# EAGLE design Spectrum_v03_g (EAGLE 7.5.4)
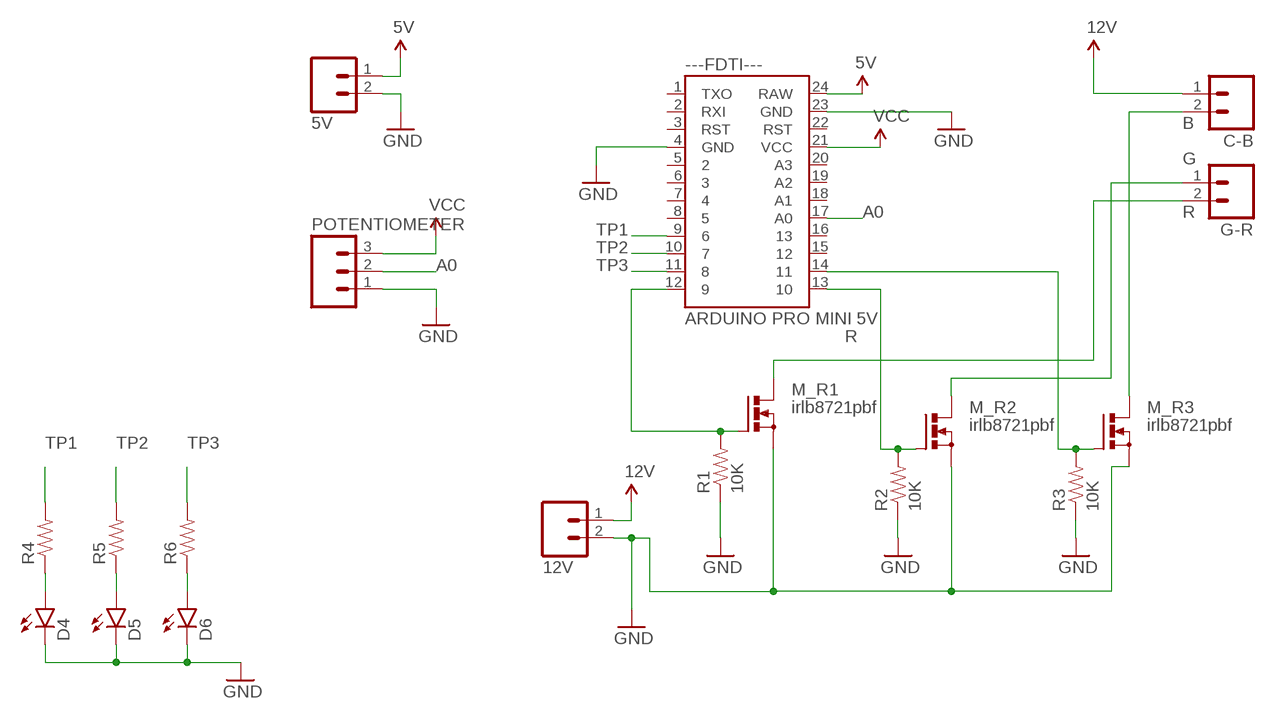
[diagram p0: schematic, sheet 1]

## Parts
5V  M025MM  [SCREWTERMINAL-5MM-2]
12V  M025MM  [SCREWTERMINAL-5MM-2]
---FDTI---  ARDUINO PRO MINI 5V  ARDUINO_MINI  [ARDUINO_MINI]
C-B  M025MM  [SCREWTERMINAL-5MM-2]
D4  LED3MM  [LED3MM]
D5  LED3MM  [LED3MM]
D6  LED3MM  [LED3MM]
G-R  M025MM  [SCREWTERMINAL-5MM-2]
M_R1  irlb8721pbf  PMOSFET_NTO220BV  [TO220BV]
M_R2  irlb8721pbf  PMOSFET_NTO220BV  [TO220BV]
M_R3  irlb8721pbf  PMOSFET_NTO220BV  [TO220BV]
POTENTIOMETER  M03-SCREW-5MM  [SCREWTERMINAL-5MM-3]
R1  10K  RESISTORPTH-1/4W  [AXIAL-0.4]
R2  10K  RESISTORPTH-1/4W  [AXIAL-0.4]
R3  10K  RESISTORPTH-1/4W  [AXIAL-0.4]
R4  RESISTOREZ  [AXIAL-0.3EZ]
R5  RESISTOREZ  [AXIAL-0.3EZ]
R6  RESISTOREZ  [AXIAL-0.3EZ]

## Nets
5V: 5V.1 ---FDTI---.24(RAW)
12V: 12V.1 C-B.1
A0: ---FDTI---.17(A0) POTENTIOMETER.2
B: C-B.2 M_R3.D
G: G-R.1 M_R2.D
GND: 5V.2 12V.2 ---FDTI---.4(GND) ---FDTI---.23(GND) D4.K(C) D5.K(C) D6.K(C) M_R1.S M_R2.S M_R3.S POTENTIOMETER.1 R1.P$1 R2.P$1 R3.P$1
N$1: ---FDTI---.12 M_R1.G R1.P$2
N$2: ---FDTI---.13 M_R2.G R2.P$2
N$3: ---FDTI---.14 M_R3.G R3.P$2
N$5: D4.A R4.P$1
N$6: D5.A R5.P$1
N$7: D6.A R6.P$1
R: G-R.2 M_R1.D
TP1: ---FDTI---.9 R4.P$2
TP2: ---FDTI---.10 R5.P$2
TP3: ---FDTI---.11 R6.P$2
VCC: ---FDTI---.21(VCC) POTENTIOMETER.3
Unconnected: ---FDTI---.1(TXO) ---FDTI---.2(RXI) ---FDTI---.3(RST) ---FDTI---.5 ---FDTI---.6 ---FDTI---.7 ---FDTI---.8 ---FDTI---.15 ---FDTI---.16 ---FDTI---.18(A1) ---FDTI---.19(A2) ---FDTI---.20(A3) ---FDTI---.22(RST)

## Library data of the parts
5V 12V C-B G-R = SparkFun-Connectors:M02: Standard 2-pin 0.1" header. Use with - straight break away headers ( PRT-00116) - right angle break away headers (PRT-00553) - swiss pins (PRT-00743) - machine pins (PRT-00117) - female headers (PRT-00115) Molex polarized connector foot print use with: PRT-08233 with associated crimp pins and housings. 2.54_SCREWTERM for use with PRT-10571. 3.5mm Screw Terminal footprints for PRT-08084 5mm Screw Terminal footprints for use with PRT-08432; STOREFRONT_ID: PRT-08432
---FDTI--- = SparkFun-Boards:ARDUINO_MINI: Arduino Pro Mini footprint
D4-D6 = SparkFun-LED:LED: LEDs Standard schematic elements and footprints for 5mm, 3mm, 1206, and 0603 sized LEDs. 5mm - Spark Fun Electronics SKU : COM-00529 (and others); PROD_ID: DIO-08794
M_R1-M_R3 = transistor-power:PMOSFET_N: Power MOSFET N-Channel
POTENTIOMETER = SparkFun-Connectors:M03: Header 3 Standard 3-pin 0.1" header. Use with straight break away headers (SKU : PRT-00116), right angle break away headers (PRT-00553), swiss pins (PRT-00743), machine pins (PRT-00117), and female headers (PRT-00115). Molex polarized connector foot print use with SKU : PRT-08232 with associated crimp pins and housings.; STOREFRONT_ID: PRT-08433
R1-R3 = SparkFun-Passives:RESISTOR: Resistor Basic schematic elements and footprints for 0603, 1206, and PTH resistors.
R4-R6 = SparkFun-Resistors:RESISTOR: Resistor Basic schematic elements and footprints for 0603, 1206, and PTH resistors.

## Board
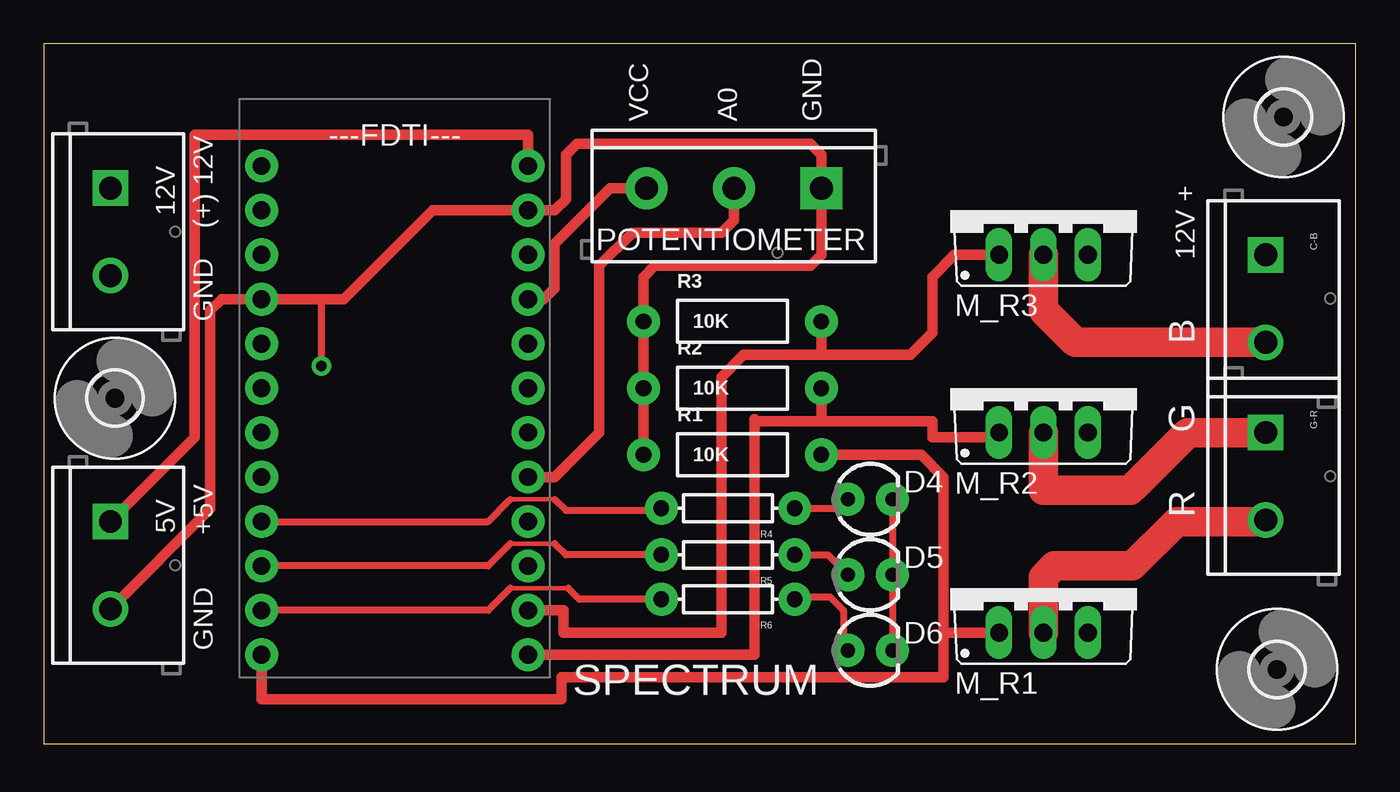
[diagram p1: board, top side]
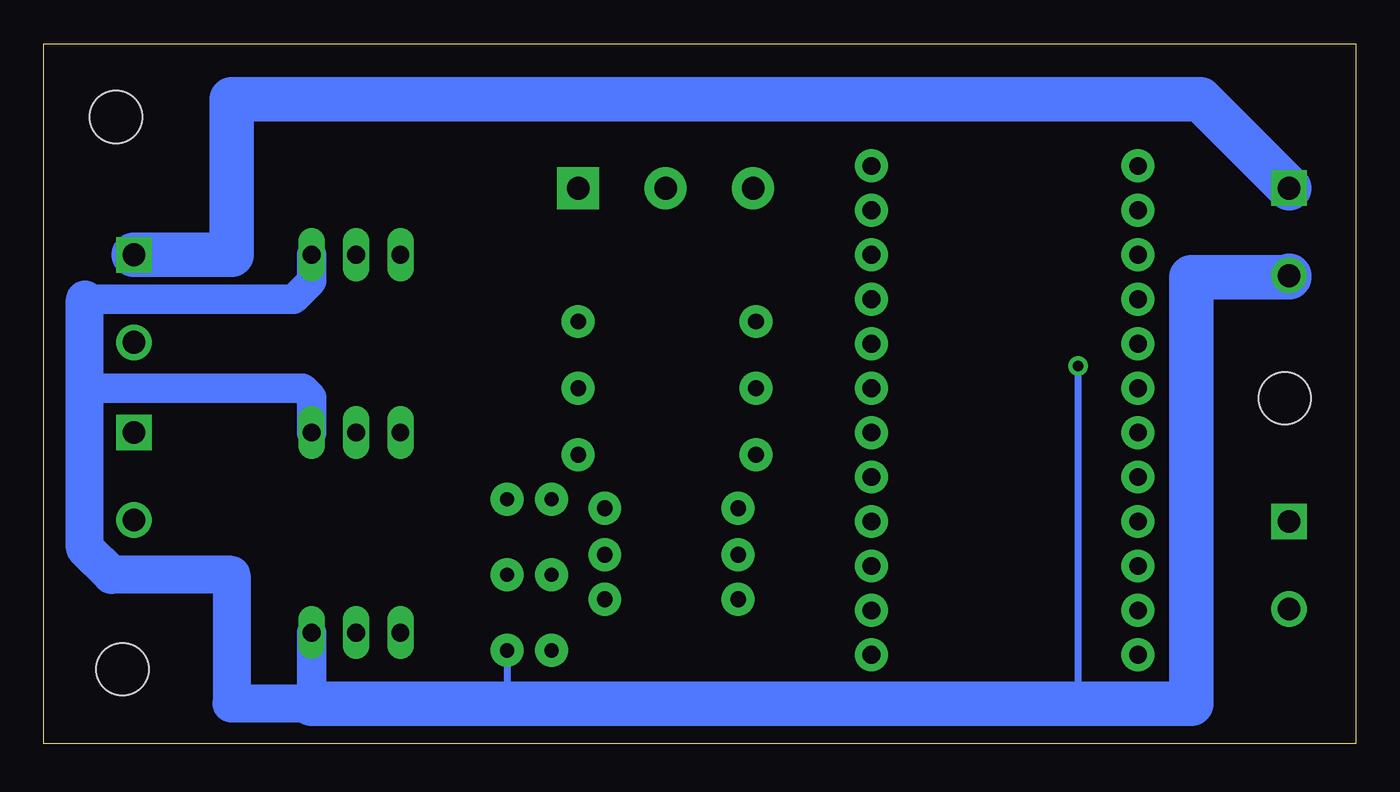
[diagram p2: board, bottom side, seen from below]

Size 75 x 40 mm. Coordinates in mm from the lower left corner, seen from the top.
Outline: 0,0 75,0 75,40 0,40 0,0
Copper layers (1*16): Top 0.035mm / dielectric 1.5mm / Bottom 0.035mm
Design rules "SparkFun-2-layer-STANDARD": minimum track width 10mil, minimum drill 20mil, track to track 10mil, track to pad 8mil, pad to pad 8mil, via to via 10mil, smd to smd 8mil, copper to edge 8mil, drill to drill 8mil, minimum pad ring 10mil, minimum via ring 10mil, stop-mask expansion 4mil, vias tented up to drill 25mil, thermal gap 10mil

### Footprints (pad centres in the part's own frame; a part is rotated, then mirrored left to right if it is on the bottom)
SCREWTERMINAL-5MM-2 = drill 1.3 pad 2.032 square: 1 0,0 | drill 1.3 pad 2.032: 2 5,0
ARDUINO_MINI = drill 1.016 pad 1.88: 1 -7.62,12.7; 2 -7.62,10.16; 3 -7.62,7.62; 4 -7.62,5.08; 5 -7.62,2.54; 6 -7.62,0; 7 -7.62,-2.54; 8 -7.62,-5.08; 9 -7.62,-7.62; 10 -7.62,-10.16; 11 -7.62,-12.7; 12 -7.62,-15.24; 13 7.62,-15.24; 14 7.62,-12.7; 15 7.62,-10.16; 16 7.62,-7.62; 17 7.62,-5.08; 18 7.62,-2.54; 19 7.62,0; 20 7.62,2.54; 21 7.62,5.08; 22 7.62,7.62; 23 7.62,10.16; 24 7.62,12.7
LED3MM = drill 0.813 pad 1.88: A -1.27,0; K 1.27,0
TO220BV = drill 1.016 long: D 0,-2.54; G -2.54,-2.54; S 2.54,-2.54
SCREWTERMINAL-5MM-3 = drill 1.3 pad 2.413 square: 1 0,0 | drill 1.3 pad 2.413: 2 5,0; 3 10,0
AXIAL-0.4 = drill 0.9 pad 1.88: P$1 -5.08,0; P$2 5.08,0
AXIAL-0.3EZ = drill 0.9 pad 1.88: P$1 -3.81,0; P$2 3.81,0
3,0 = hole 3: 0,0

### Placement (x,y rotation side)
5V  3.81,12.7 270 top
12V  3.81,31.75 270 top
---FDTI---  20.07,20.32 0 top
C-B  69.85,27.94 270 top
D4  47.24,13.97 0 top
D5  47.24,9.65 0 top
D6  47.24,5.33 0 top
G-R  69.85,17.78 270 top
M_R1  57.15,8.89 0 top
M_R2  57.15,20.32 0 top
M_R3  57.15,30.48 0 top
POTENTIOMETER  44.45,31.75 180 top
R1  39.37,16.51 0 top
R2  39.37,20.32 0 top
R3  39.37,24.13 0 top
R4  39.12,13.46 180 top
R5  39.12,10.79 180 top
R6  39.12,8.26 180 top
U$2  [3,0]  4.06,19.75 0 top
U$3  [3,0]  70.87,35.81 180 top
U$4  [3,0]  70.5,4.25 0 top

### Tracks (layer width: path | path; a pad name or v marks a point on that pad's centre or on a via)
5V
  Top 0.61: 5V.1 8.64,17.53 8.64,34.8 27.69,34.8 ---FDTI---.24
12V
  Bottom 2.54: 12V.1 8.89,36.83 64.26,36.83 64.26,27.94 C-B.1
A0
  Top 0.61: POTENTIOMETER.2 39.45,29.93 38.73,29.21 33.66,29.21 31.75,27.3 31.75,17.78 29.21,15.24 ---FDTI---.17
B
  Top 1.676: C-B.2 58.98,22.94 57.15,24.77 M_R3.D
G
  Top 0.406: 62.1,14.48 62.23,14.61
  Top 1.676: G-R.1 65.41,17.78 62.23,14.61 | M_R2.D 57.15,14.48 62.1,14.48
GND  (via drill 0.6)
  Top 0.406: v15.88,21.59 15.88,25.4 | D4.K D5.K D6.K
  Top 0.61: R1.P$1 R2.P$1 R3.P$1 34.29,26.67 34.92,27.3 43.81,27.3 44.45,27.94 POTENTIOMETER.1 44.45,33.66 43.81,34.29 30.48,34.29 29.84,33.66 29.84,31.11 29.21,30.48 ---FDTI---.23 22.23,30.48 17.14,25.4 15.88,25.4 ---FDTI---.4 10.16,25.4 9.53,24.77 9.53,13.41 5V.2
  Bottom 0.406: v15.88,21.59 15.88,2.29 | D6.K 48.51,2.54 48.26,2.29
  Bottom 1.676: M_R3.S 59.69,26.42 60.71,25.4 72.64,25.4 | M_R2.S 59.69,19.81 60.2,20.32 72.64,20.32 | M_R1.S 59.69,2.29
  Bottom 2.184: 59.69,2.29 64.26,2.29 64.26,9.65 71.12,9.65 72.64,11.18 72.64,20.32 72.64,25.4
  Bottom 2.54: 59.69,2.29 48.26,2.29 15.88,2.29 9.4,2.29 9.4,26.67 3.81,26.67 12V.2
N$1
  Top 0.61: ---FDTI---.12 12.45,2.54 29.59,2.54 29.59,3.81 51.44,3.81 51.44,6.35 | 51.44,6.35 M_R1.G | 51.44,6.35 51.44,15.24 50.16,16.51 R1.P$2
N$2
  Top 0.61: ---FDTI---.13 40.64,5.08 40.64,18.41 | 44.45,18.41 50.8,18.41 50.8,17.53 54.36,17.53 M_R2.G | R2.P$2 44.45,18.41 | 44.45,18.41 40.64,18.41 | 40.64,18.41 40.64,18.54
N$3
  Top 0.61: 44.45,22.23 40.01,22.23 38.73,20.95 38.73,6.35 29.72,6.35 29.72,7.62 ---FDTI---.14 | 44.45,22.23 49.53,22.23 50.8,23.5 50.8,26.67 52.07,27.94 M_R3.G | R3.P$2 44.45,22.23
N$5
  Top 0.406: R4.P$1 45.47,13.46 D4.A
N$6
  Top 0.406: R5.P$1 44.83,10.79 D5.A
N$7
  Top 0.406: D6.A 45.72,5.59 45.72,7.62 44.96,8.38 43.05,8.38 R6.P$1
R
  Top 1.676: M_R1.D 57.15,9.53 57.78,10.16 62.23,10.16 64.77,12.7 69.77,12.7 G-R.2
TP1
  Top 0.254: 26.67,13.97 29.21,13.97
  Top 0.406: ---FDTI---.9 25.4,12.7 26.67,13.97 | 29.21,13.97 29.84,13.34 35.18,13.34 R4.P$2
TP2
  Top 0.254: 29.21,11.43 26.67,11.43
  Top 0.406: R5.P$2 29.84,10.79 29.21,11.43 | 26.67,11.43 25.4,10.16 ---FDTI---.10
TP3
  Top 0.254: 29.97,8.89 26.67,8.89
  Top 0.406: 29.97,8.89 30.61,8.26 R6.P$2 | 26.67,8.89 25.4,7.62 ---FDTI---.11
VCC
  Top 0.61: POTENTIOMETER.3 32.38,31.75 29.21,28.57 29.21,26.04 28.57,25.4 ---FDTI---.21

### Text on the board
tNames: SPECTRUM
tSilk: VCC | A0 | GND | (+) 12V | 12V + | GND | B | G | R | +5V | GND